# Altium schematic sheet Digital_Output.SchDoc
size A3; SheetNumber: 11; SheetTotal: 29
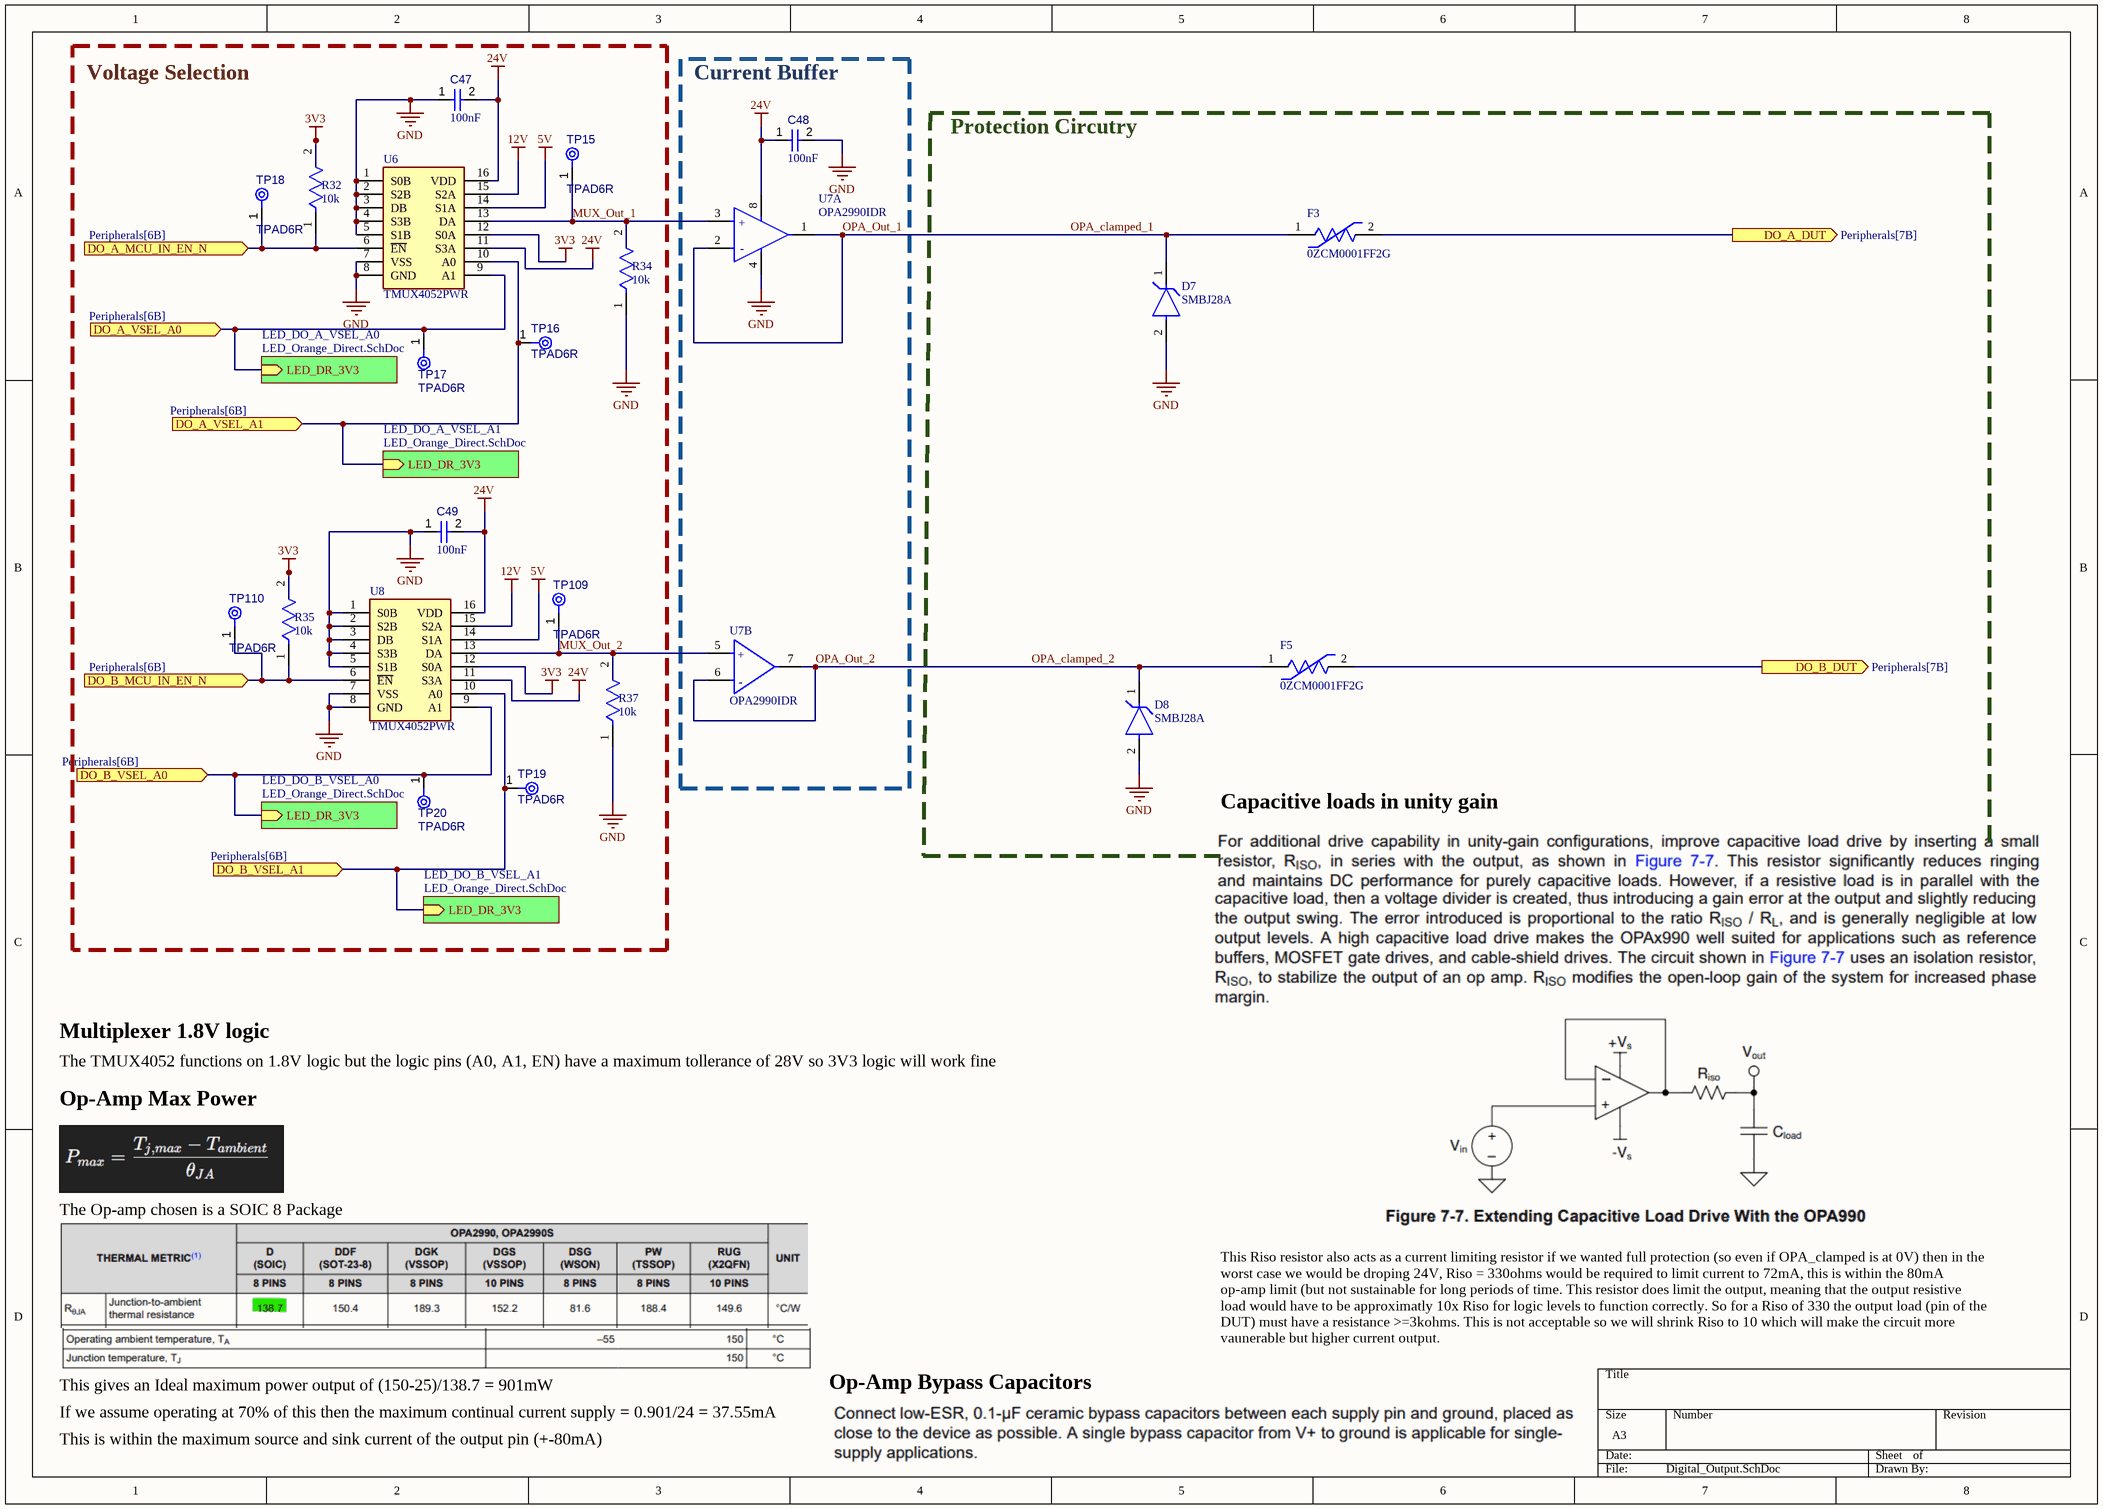
[diagram p0: Digital_Output.SchDoc]

## Parts
C47  value 100nF  [CAPC1608X90X40NL10T20]  (hidden comment: Capacitor 100 nF +/-10% 50 V 0603)
C48  value 100nF  [CAPC1608X90X40NL10T20]  (hidden comment: Capacitor 100 nF +/-10% 50 V 0603)
C49  value 100nF  [CAPC1608X90X40NL10T20]  (hidden comment: Capacitor 100 nF +/-10% 50 V 0603)
D7  SMBJ28A  [FP-SMBJ-MFG]
D8  SMBJ28A  [FP-SMBJ-MFG]
F3  0ZCM0001FF2G  [FP-0ZCM0001FF2G-MFG]
F5  0ZCM0001FF2G  [FP-0ZCM0001FF2G-MFG]
R32  value 10k  [FP-RT0603-IPC_C]  (hidden comment: RT0603BRD0710KL)
R34  value 10k  [FP-RT0603-IPC_C]  (hidden comment: RT0603BRD0710KL)
R35  value 10k  [FP-RT0603-IPC_C]  (hidden comment: RT0603BRD0710KL)
R37  value 10k  [FP-RT0603-IPC_C]  (hidden comment: RT0603BRD0710KL)
TP15  TPAD6R  [TP06R]  (no BOM)
TP16  TPAD6R  [TP06R]  (no BOM)
TP17  TPAD6R  [TP06R]  (no BOM)
TP18  TPAD6R  [TP06R]  (no BOM)
TP19  TPAD6R  [TP06R]  (no BOM)
TP20  TPAD6R  [TP06R]  (no BOM)
TP109  TPAD6R  [TP06R]  (no BOM)
TP110  TPAD6R  [TP06R]  (no BOM)
U6  TMUX4052PWR  [SOP65P640X120-16N]
U7  OPA2990IDR  [FP-D0008A-IPC_A]  (parts A,B of 2)
U8  TMUX4052PWR  [SOP65P640X120-16N]

## Blocks framed on the sheet
Voltage Selection: C47 C49 R32 R34 R35 R37 TP15-TP20 TP109 TP110 U6 U8
Current Buffer: C48 U7

## Sub-sheets
LED_DO_A_VSEL_A0 = LED_Orange_Direct.SchDoc: LED_DR_3V3 (in)
LED_DO_A_VSEL_A1 = LED_Orange_Direct.SchDoc: LED_DR_3V3 (in)
LED_DO_B_VSEL_A0 = LED_Orange_Direct.SchDoc: LED_DR_3V3 (in)
LED_DO_B_VSEL_A1 = LED_Orange_Direct.SchDoc: LED_DR_3V3 (in)

## Ports
DO_A_DUT (out, see Peripherals[7B]), DO_A_MCU_IN_EN_N (in, see Peripherals[6B]), DO_A_VSEL_A0 (in, see Peripherals[6B]), DO_A_VSEL_A1 (in, see Peripherals[6B]), DO_B_DUT (out, see Peripherals[7B]), DO_B_MCU_IN_EN_N (in, see Peripherals[6B]), DO_B_VSEL_A0 (in, see Peripherals[6B]), DO_B_VSEL_A1 (in, see Peripherals[6B])

## Nets
3V3: R32.2 R35.2 U6.12(S0A) U8.12(S0A)
5V: U6.14(S1A) U8.14(S1A)
12V: U6.15(S2A) U8.15(S2A)
24V: C47.2 C48.1 C49.2 U6.11(S3A) U6.16(VDD) U7.8(V+) U8.11(S3A) U8.16(VDD)
GND: C47.1 C48.2 C49.1 D7.2(A) D8.2(A) R34.1 R37.1 U6.1(S0B) U6.2(S2B) U6.3(DB) U6.4(S3B) U6.5(S1B) U6.7(VSS) U6.8(GND) U7.4(V-) U8.1(S0B) U8.2(S2B) U8.3(DB) U8.4(S3B) U8.5(S1B) U8.7(VSS) U8.8(GND)
DO_A_DUT: F3.2 ; port DO_A_DUT
DO_A_MCU_IN_EN_N: R32.1 TP18.1(TP) U6.6(~{EN}) ; port DO_A_MCU_IN_EN_N
DO_A_VSEL_A0: TP17.1(TP) U6.9(A1) ; port DO_A_VSEL_A0, sheet LED_DO_A_VSEL_A0/LED_DR_3V3
DO_A_VSEL_A1: TP16.1(TP) U6.10(A0) ; port DO_A_VSEL_A1, sheet LED_DO_A_VSEL_A1/LED_DR_3V3
DO_B_DUT: F5.2 ; port DO_B_DUT
DO_B_MCU_IN_EN_N: R35.1 TP110.1(TP) U8.6(~{EN}) ; port DO_B_MCU_IN_EN_N
DO_B_VSEL_A0: TP20.1(TP) U8.9(A1) ; port DO_B_VSEL_A0, sheet LED_DO_B_VSEL_A0/LED_DR_3V3
DO_B_VSEL_A1: TP19.1(TP) U8.10(A0) ; port DO_B_VSEL_A1, sheet LED_DO_B_VSEL_A1/LED_DR_3V3
MUX_Out_1: R34.2 TP15.1(TP) U6.13(DA) U7.3(IN1+)
MUX_Out_2: R37.2 TP109.1(TP) U7.5(IN2+) U8.13(DA)
OPA_clamped_1: D7.1(C) F3.1 U7.1(OUT1) U7.2(IN1-)  [also labelled OPA_Out_1]
OPA_clamped_2: D8.1(C) F5.1 U7.6(IN2-) U7.7(OUT2)  [also labelled OPA_Out_2]

## Notes on the sheet
- Protection Circutry
- Capacitive loads in unity gain
- Multiplexer 1.8V logic
- The TMUX4052 functions on 1.8V logic but the logic pins (A0, A1, EN) have a maximum tollerance of 28V so 3V3 logic will work fine
- Op-Amp Max Power
- The Op-amp chosen is a SOIC 8 Package
- This gives an Ideal maximum power output of (150-25)/138.7 = 901mW
- Op-Amp Bypass Capacitors
- This Riso resistor also acts as a current limiting resistor if we wanted full protection (so even if OPA_clamped is at 0V) then in the worst case we would be droping 24V, Riso = 330ohms would be required to limit current to 72mA, this is within the 80mA op-amp limit (but not sustainable for long periods of time. This resistor does limit the output, meaning that the output resistive load would have to be approximatly 10x Riso for logic levels to function correctly. So for a Riso of 330 the output load (pin of the DUT) must have a resistance >=3kohms. This is not acceptable so we will shrink Riso to 10 which will make the circuit more vaunerable but higher current output.
- If we assume operating at 70% of this then the maximum continual current supply = 0.901/24 = 37.55mA
- This is within the maximum source and sink current of the output pin (+-80mA)
- (in symbol CMP-014-00003-1, part A) +; -
- (in symbol CMP-014-00003-1, part B) +; -

## Library data of the parts
C47-C49 = CMP-001-00017-6: Chip Capacitor, 100 nF, +/- 10%, 50 V, 0603 (1608 Metric); Voltage Rating: 50V; Capacitor Type: Ceramic; Tolerance: 10%; Mounting Technology: SM; Max Operating Temperature: 125°C; RoHS Compliant: True; Pins: 2; Case/Package: 0603; Min Operating Temperature: -55°C
D7 D8 = CMP-004-00070-1: Tvs Diodes & Esd Suppressors; SMBJ28A; Littelfuse; 28 V; 45.4 V; 31.1 V; 31.1 V; Power Line Protection: No; Clamping Voltage: 45.4V; Number of Channels: 1; Power Rating: 600W; Voltage Rating (DC): 28V; Polarity: Unidirectional; Breakdown Voltage: 32.75V; Element Configuration: Single; Leakage Current: 1µA; Current: 1mA; Max Breakdown Voltage: 34.4V; Forward Voltage: 3.5V; Max Power Dissipation: 5W; Min Breakdown Voltage: 31.1V; Max Junction Temperature (Tj): 150°C; Max Surge Current: 13.3A; Height: 2.61mm; Number of Elements: 1; Power Dissipation: 600W; Case/Package: SMB; Termination: SMD/SMT; Radiation Hardening: No; Mounting Technology: Surface Mount; Lifecycle Status: Production; Direction: Unidirectional; Number of Unidirectional Channels: 1; Reverse Voltage: 28V; Peak Reverse Current: 1µA; Voltage: 28V; Operating Supply Voltage: 28V; Min Operating Temperature: -65°C; Schedule B: 8541100080, 8541100080; REACH SVHC: No; Length: 4.57mm; Packaging: Cut Tape; Country of Origin: Mainland China, Philippines; Test Current: 1mA; Introduction Date: 1996-01-01; Lead Free: Lead Free; Max Operating Temperature: 150°C; Composition: Zener; Pins: 2; Width: 3.94mm; Number of Terminals: 2; Reverse Standoff Voltage: 28V; Harmonized Tariff Schedule (HTS) Code: 8541.10.00.50; RoHS: Compliant; Peak Pulse Power: 600W; Export Control Classification Number (ECCN) Code: EAR99; Max Reverse Leakage Current: 1µA; Reverse Breakdown Voltage: 31.1V; Peak Pulse Current: 13.3A
F3 F5 = CMP-005-00023-1: Prices include import duty and tax. RESETTABLE PTC FUSE, SMD, 0603 SIZE, 10MA, 60V;; Trip Current: 30mA; Value: 15Ω; Maximum Resistance 1 Hour (R1max): 100Ω; Ratings: AEC-Q200, TUV; Time to Trip: 1s; Current Rating: 40A; REACH SVHC: Yes; Voltage Rating: 60V; Harmonized Tariff Schedule (HTS) Code: 8533.40.80.70; Mounting Technology: Surface Mount; Length: 1.8mm; Min Operating Temperature: -40°C; Max Operating Temperature: 85°C; Width: 1mm; Export Control Classification Number (ECCN) Code: EAR99; Height: 850µm; Working Voltage: 60V; Case/Package: 0603; RoHS: Compliant; Lifecycle Status: Production; Hold Current: 10mA; Number of Terminals: 2; China RoHS: Compliant; Introduction Date: 2019-09-26
R32 R34 R35 R37 = CMP-009-00322-1: Res Thin Film 0603 10K Ohm 0.1% 1/10W |25ppm/|C SMD Paper T/R; Voltage Rating: 75V; Max Power Dissipation: 100mW; Temperature Coefficient: 25ppm/°C; Min Operating Temperature: -55°C; Case/Package: 0603; Mounting Technology: Surface Mount; Max Operating Temperature: 155°C; Tolerance: 0.1%; Case Code (Imperial): 0603; China RoHS: Non-Compliant; Composition: Thin Film; Country of Origin: Mainland China, Taiwan; Depth: 800µm; Export Control Classification Number (ECCN) Code: EAR99; Features: Moisture Resistant; Harmonized Tariff Schedule (HTS) Code: 8533.21.00.30; Height: 450µm; Introduction Date: 2008-06-09; Lead Free: Lead Free; Length: 1.6mm; Lifecycle Status: Production; Military Standard: Not; Number of Terminals: 2; Number of Terminations: 2; Power Rating: 100mW; REACH SVHC: Yes; RoHS: Compliant; Schedule B: 8533210045, 8533210045; Termination: SMD/SMT; Voltage Rating (DC): 75V; Weight: 2.012816mg; Width: 800µm; Working Voltage: 75V
TP15-TP20 TP109 TP110 = CMP-00028-00002-2: 0.6mm round; Pins: 1
U6 U8 = CMP-031-00021-1: Texas Instruments; Arrow Price/Stock: https://www.arrow.com/en/products/tmux4052pwr/texas-instruments.html?utm_currency=USD&region=nac; Manufacturer_Name: Texas Instruments; Manufacturer_Part_Number: TMUX4052PWR; Datasheet Link: https://www.ti.com/lit/ds/symlink/tmux4052.pdf?ts=1676371866155&ref_url=https%253A%252F%252Fwww.ti.com%252Fproduct%252FTMUX4052; Mouser Price/Stock: https://www.mouser.co.uk/ProductDetail/Texas-Instruments/TMUX4052PWR?qs=amGC7iS6iy8OsL8GnYryxg%3D%3D; Arrow Part Number: TMUX4052PWR; Height: 1.2mm; Source: MAX17643ATC+.SchLib; Design Item ID: TMUX4052PWR; Mouser Part Number: 595-TMUX4052PWR
U7 = CMP-014-00003-1: IC OPAMP GP 2 CIRCUIT 8SOIC / General Purpose Amplifier 2 Circuit Rail-to-Rail 8-SOIC; Manufacturer Lifecycle Status: ACTIVE; Output Current per Channel: 80mA; Max Junction Temperature (Tj): 150°C; Max Dual Supply Voltage: 20V; Min Dual Supply Voltage: 1.35V; Number of Channels: 2; Input Offset Voltage (Vos): 300µV; Input Bias Current: 10pA; Max Supply Voltage: 40V; Nominal Supply Current: 120µA; Min Supply Voltage: 2.7V; Ambient Temperature Range High: 125°C; Schedule B: 8542330000; Height: 1.75mm; Pins: 8; Length: 4.9mm; Width: 3.91mm; Max Operating Temperature: 125°C; Case/Package: SOIC; Lifecycle Status: Production; RoHS: Compliant; Thickness: 1.58mm; Min Operating Temperature: -40°C